# EAGLE design pinoccio-proto (EAGLE 6.2)
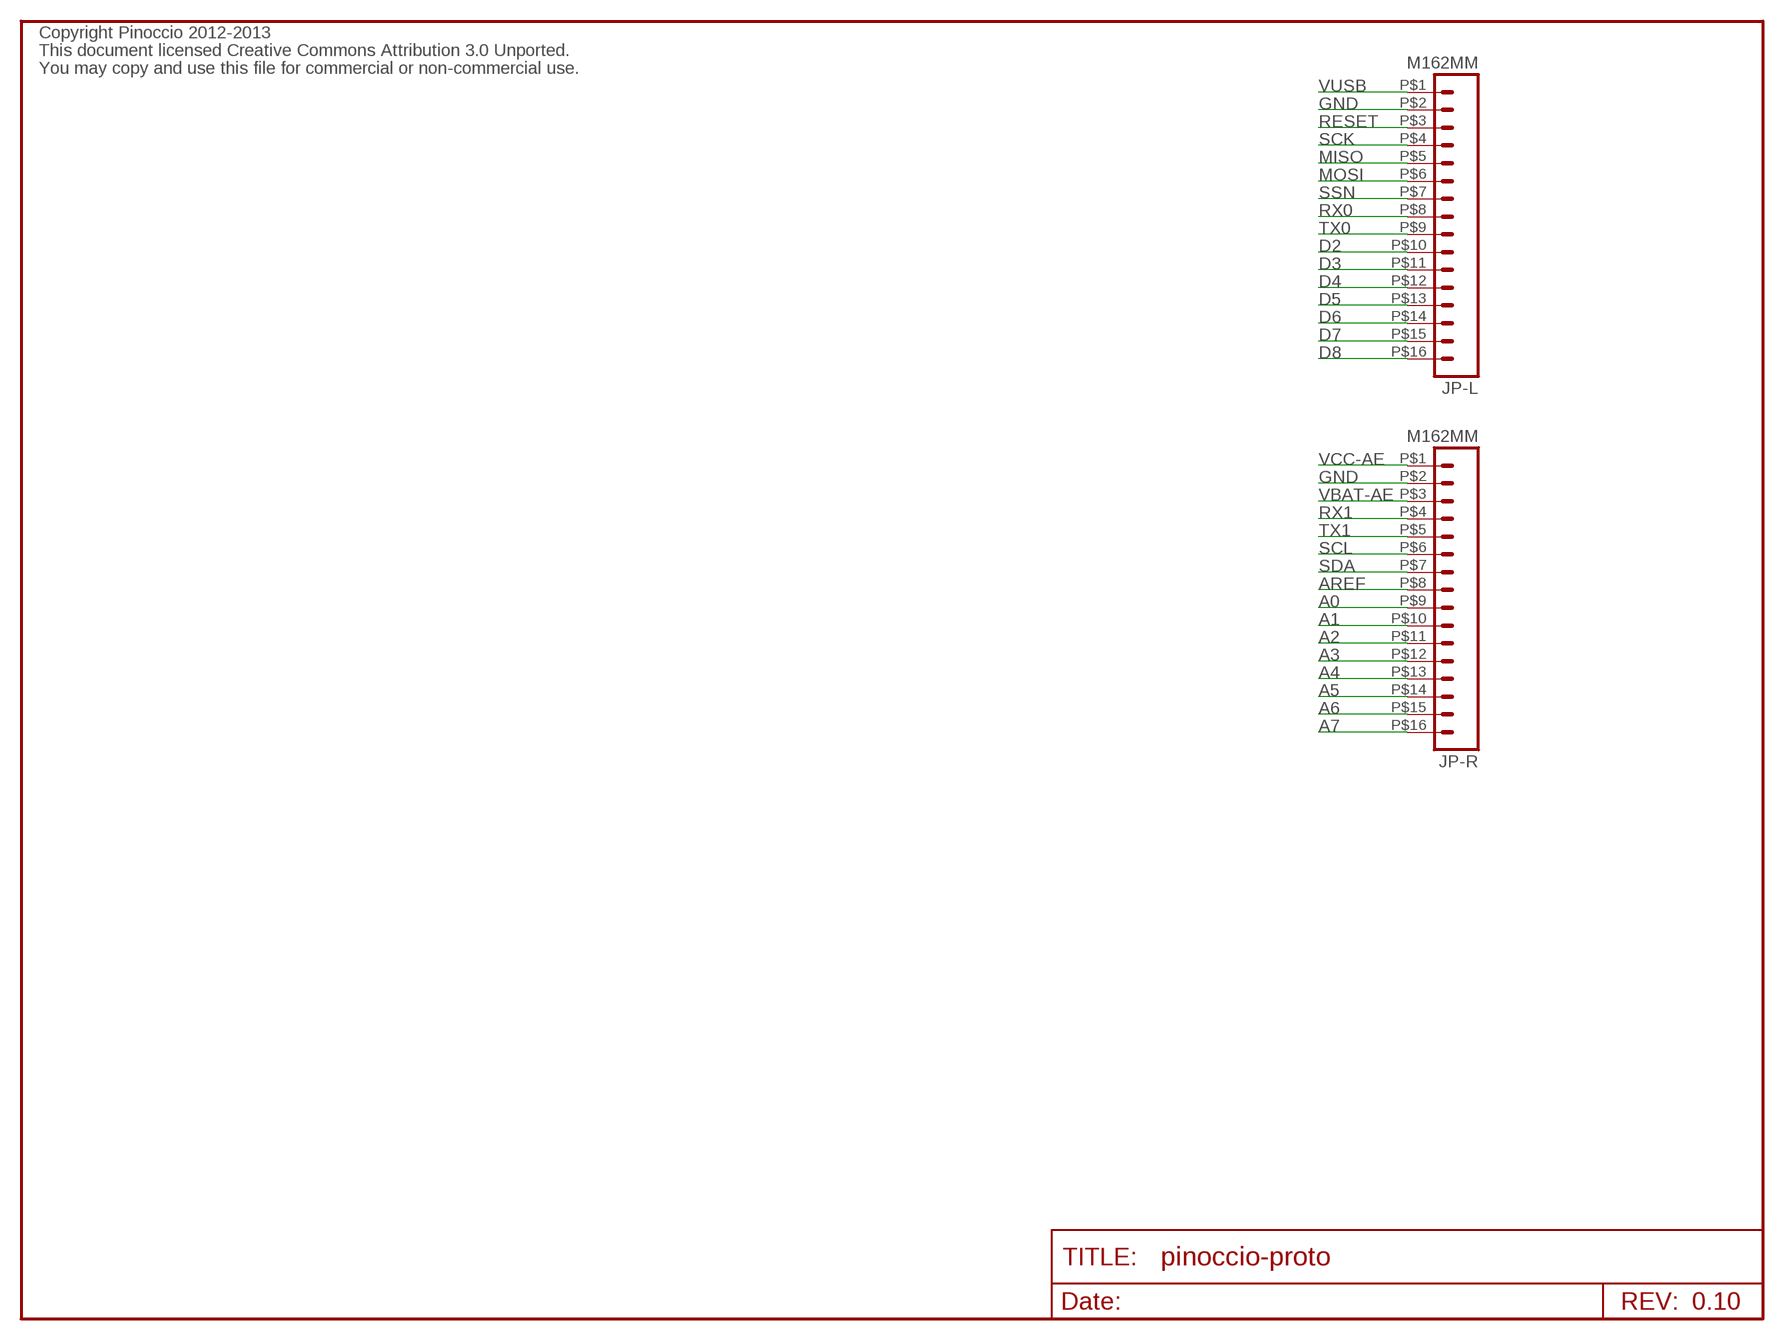
[diagram p0: schematic, sheet 1]

## Parts
JP-L  M162MM  [1X16_2MM]
JP-R  M162MM  [1X16_2MM]

## Nets
A0: JP-R.P$9
A1: JP-R.P$10
A2: JP-R.P$11
A3: JP-R.P$12
A4: JP-R.P$13
A5: JP-R.P$14
A6: JP-R.P$15
A7: JP-R.P$16
AREF: JP-R.P$8
D2: JP-L.P$10
D3: JP-L.P$11
D4: JP-L.P$12
D5: JP-L.P$13
D6: JP-L.P$14
D7: JP-L.P$15
D8: JP-L.P$16
GND [GND]: JP-L.P$2 JP-R.P$2
MISO: JP-L.P$5
MOSI: JP-L.P$6
RESET: JP-L.P$3
RX0: JP-L.P$8
RX1: JP-R.P$4
SCK: JP-L.P$4
SCL: JP-R.P$6
SDA: JP-R.P$7
SSN: JP-L.P$7
TX0: JP-L.P$9
TX1: JP-R.P$5
VBAT-AE: JP-R.P$3
VCC-AE: JP-R.P$1
VUSB: JP-L.P$1

## Notes on the sheet
- Copyright Pinoccio 2012-2013
- This document licensed Creative Commons Attribution 3.0 Unported.
- You may copy and use this file for commercial or non-commercial use.
- 0.10
- /Volumes/Data/Users/eric/Desktop/pinoccio.bmp
- /Volumes/Data/Users/eric/Desktop/pinoccio-1in.bmp | /Volumes/Data/Users/eric/Desktop/pinoccio-full-3-4in.bmp | /Volumes/Data/Users/eric/Desktop/pinoccio-full-3-4in.bmp

## Library data of the parts
JP-L JP-R = Pinoccio:M16

## Net classes
0 Default: width 0.203 mm
1 VCC: width 0.305 mm
2 LEDPower: width 0.203 mm
3 ButtonSignal: width 0.203 mm
4 RF Antenna: width 0.305 mm
5 GND: width 0.203 mm

## Board
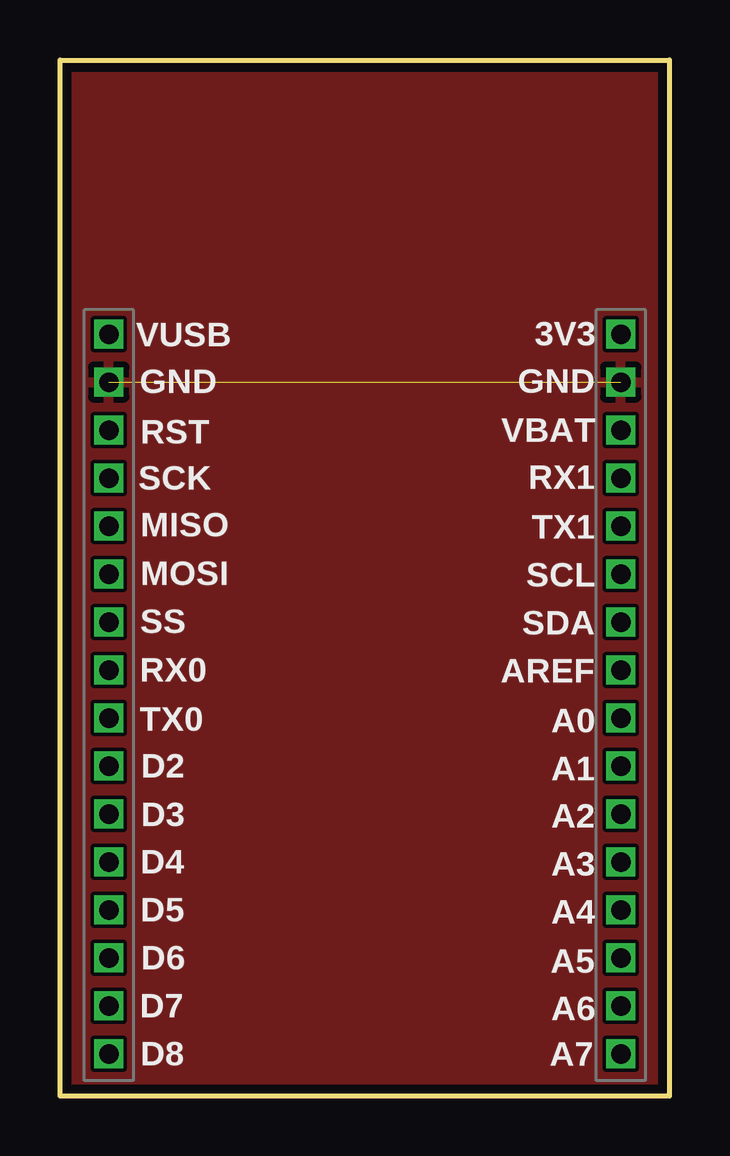
[diagram p1: board, top side]
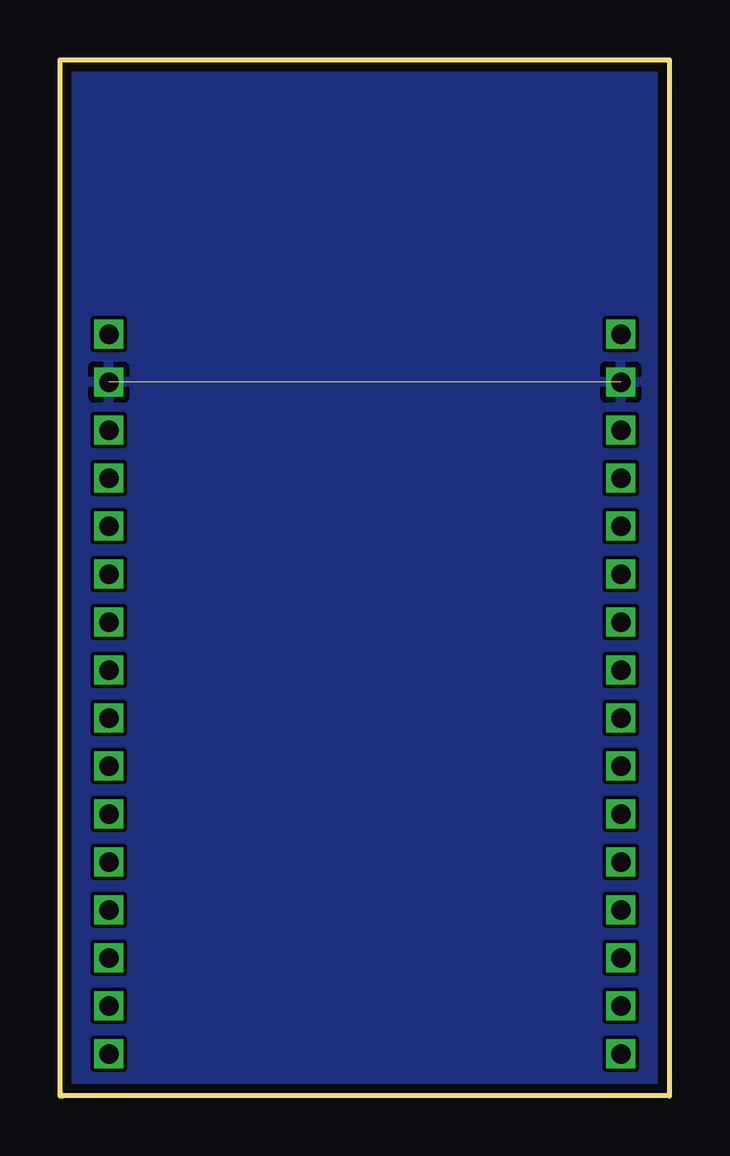
[diagram p2: board, bottom side, seen from below]

Size 25.4 x 43.18 mm. Coordinates in mm from the lower left corner, seen from the top.
Outline: 0,0 0,43.18 25.4,43.18 25.4,0
Outline: 0.03,0 25.3,0 25.32,0.02
Copper layers (1*16): Top 0.0356mm / dielectric 1.5011mm / Bottom 0.0356mm
Design rules: minimum track width 6mil, minimum drill 13mil, track to track 6mil, track to pad 6mil, pad to pad 6mil, via to via 6mil, smd to smd 6mil, copper to edge 15mil, drill to drill 6mil, minimum pad ring 7mil, minimum via ring 7mil, stop-mask expansion 4mil, vias tented up to drill 16mil, thermal gap 10mil

### Footprints (pad centres in the part's own frame; a part is rotated, then mirrored left to right if it is on the bottom)
1X16_2MM = drill 0.813 square: P$1 0,0; P$2 2,0; P$3 4,0; P$4 6,0; P$5 8,0; P$6 10,0; P$7 12,0; P$8 14,0; P$9 16,0; P$10 18,0; P$11 20,0; P$12 22,0; P$13 24,0; P$14 26,0; P$15 28,0; P$16 30,0

### Placement (x,y rotation side)
JP-L  2.03,31.75 270 top
JP-R  23.37,31.75 270 top

### Tracks (layer width: path | path; a pad name or v marks a point on that pad's centre or on a via)
A0
  Bottom 0.305: JP-R.P$9
A1
  Bottom 0.305: JP-R.P$10
A2
  Bottom 0.305: JP-R.P$11
A3
  Bottom 0.305: JP-R.P$12
A4
  Bottom 0.305: JP-R.P$13
A5
  Bottom 0.305: 23.37,5.77 JP-R.P$14
A6
  Bottom 0.305: JP-R.P$15
A7
  Bottom 0.305: JP-R.P$16
AREF
  Bottom 0.305: 23.37,17.73 JP-R.P$8
D2
  Bottom 0.305: JP-L.P$10
D3
  Bottom 0.305: JP-L.P$11
D4
  Bottom 0.305: JP-L.P$12
D5
  Bottom 0.305: JP-L.P$13
D6
  Bottom 0.305: JP-L.P$14
D7
  Bottom 0.305: 2.03,3.78 JP-L.P$15
D8
  Bottom 0.305: JP-L.P$16
GND  (1 unrouted)
  pour Top: 0.08,43.33 0.03,43.33 0.03,-0.03 25.37,-0.03 25.37,0 25.37,43.28 0.08,43.28
  pour Bottom: 0.08,43.15 0.03,43.15 0.03,0.03 24.89,0 25.07,0 25.37,-0.03 25.37,43.26 0.1,43.26
MISO
  Bottom 0.305: JP-L.P$5
MOSI
  Bottom 0.305: 2.03,21.72 JP-L.P$6
RESET
  Bottom 0.305: 2.03,27.74 JP-L.P$3
RX0
  Bottom 0.305: 2.03,17.73 JP-L.P$8
RX1
  Bottom 0.305: 23.37,25.73 JP-R.P$4
SCK
  Bottom 0.305: JP-L.P$4
SCL
  Bottom 0.305: JP-R.P$6
SDA
  Bottom 0.305: 23.37,19.76 JP-R.P$7
SSN
  Bottom 0.305: 2.03,19.74 JP-L.P$7
TX0
  Bottom 0.305: JP-L.P$9
TX1
  Bottom 0.305: 23.37,23.72 JP-R.P$5
VBAT-AE
  Bottom 0.305: 23.37,27.74 JP-R.P$3

### Text on the board
tPlace: 3V3 | VUSB | GND | GND | VBAT | RST | RX1 | SCK | TX1 | MISO | SCL | MOSI | SDA | SS | AREF | RX0 | A0 | TX0 | A1 | D2 | A2 | D3 | A3 | D4 | A4 | D5 | A5 | D6 | A6 | D7 | A7 | D8
tDocu: Pinoccio(tm) Shield Reference v0.10 | Design by: Eric Jennings for Pinoccio | http://pinocc.io | Licensed under Creative Commons Attribution 3.0 Unported.